# Altium project PCB_Project1.PrjPCB
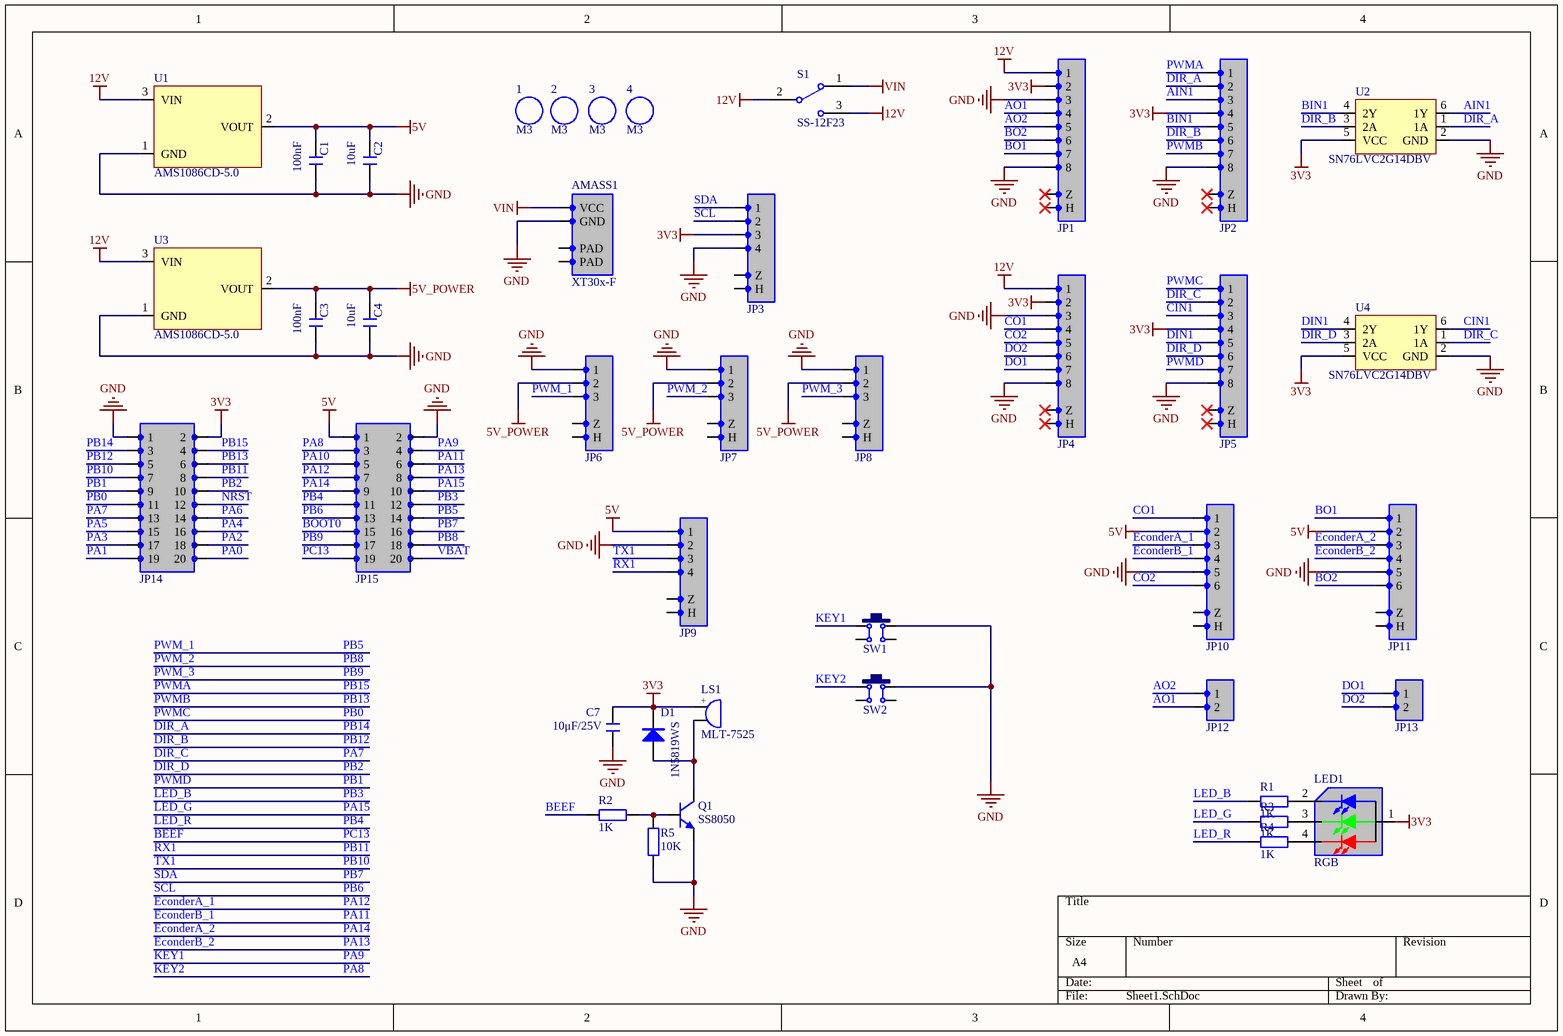
[diagram p0: Sheet1.SchDoc]
1 sheet, 41 parts. Net scope: global (net labels, ports and power ports of the same name join across sheets).
Board file: PCB2.PcbDoc

## Sheet Sheet1.SchDoc
size A4

### Parts
1  M3  [M3 125X200]
2  M3  [M3 125X200]
3  M3  [M3 125X200]
4  M3  [M3 125X200]
AMASS1  XT30x-F  [XT30U-M]
C1  100nF  [C 0603_L]
C2  10uF  [C 0603_L]
C3  100nF  [C 0603_L]
C4  10uF  [C 0603_L]
C7  10μF/25V  [C 0603_L]
D1  1N5819WS  [SOD-323]
JP1  HDR-1X8  [HDR2.54-M-LI-8P]  (value not drawn)
JP2  HDR-1X8  [HDR2.54-M-LI-8P]  (value not drawn)
JP3  HDR-1X4  [HDR2.54-M-LI-4P]  (value not drawn)
JP4  HDR-1X8  [HDR2.54-M-LI-8P]  (value not drawn)
JP5  HDR-1X8  [HDR2.54-M-LI-8P]  (value not drawn)
JP6  HDR-1X3  [HDR2.54-LI-3P]  (value not drawn)
JP7  HDR-1X3  [HDR2.54-LI-3P]  (value not drawn)
JP8  HDR-1X3  [HDR2.54-LI-3P]  (value not drawn)
JP9  HDR-1X4  [HDR2.54-LI-4P]  (value not drawn)
JP10  HDR-1X6  [XH2.54-WI-6P]  (value not drawn)
JP11  HDR-1X6  [XH2.54-WI-6P]  (value not drawn)
JP12  HDR-1X2  [XH2.54-WI-2P]  (value not drawn)
JP13  HDR-1X2  [XH2.54-WI-2P]  (value not drawn)
JP14  Header 2X10  [HDR2.54-LI-2x10P]  (value not drawn)
JP15  Header 2X10  [HDR2.54-LI-2x10P]  (value not drawn)
LED1  RGB  [LED 3528-RGB]
LS1  MLT-7525  [BUZZER_7525_S]
Q1  SS8050  [SOT23-3L]
R1  1K  [R 0603_L]
R2  1K  [R 0603_L]
R3  1K  [R 0603_L]
R4  1K  [R 0603_L]
R5  10K  [R 0603_L]
S1  SS-12F23  [SS-12D10]
SW1  6x6x5  [TSW SMD-3*4*2]  (value not drawn)
SW2  6x6x5  [TSW SMD-3*4*2]  (value not drawn)
U1  AMS1086CD-5.0  [TO252]
U2  SN76LVC2G14DBV  [SOT23-6N]
U3  AMS1086CD-5.0  [TO252]
U4  SN76LVC2G14DBV  [SOT23-6N]

### Nets
3V3: C7.1 D1.2(K) JP1.2 JP2.4 JP3.3 JP4.2 JP5.4 JP14.2 LED1.1 LS1.1 U2.5(VCC) U4.5(VCC)
5V: C1.1 C2.1 JP9.1 JP10.2 JP11.2 JP15.1 U1.2(VOUT)
5V_POWER: C3.1 C4.1 JP6.2 JP7.2 JP8.2 U3.2(VOUT)
12V: JP1.1 JP4.1 S1.2 S1.3 U1.3(VIN) U3.3(VIN)
GND: AMASS1.2(GND) C1.2 C2.2 C3.2 C4.2 C7.2 JP1.3 JP1.8 JP2.8 JP3.4 JP4.3 JP4.8 JP5.8 JP6.1 JP7.1 JP8.1 JP9.2 JP10.5 JP11.5 JP14.1 JP15.2 Q1.2(E) R5.2 SW1.2 SW2.2 U1.1(GND) U2.2(GND) U3.1(GND) U4.2(GND)
VIN: AMASS1.1(VCC) S1.1
AIN1: JP2.3 U2.6(1Y)
AO1: JP1.4 JP12.2
AO2: JP1.5 JP12.1
BEEF: JP15.19 R2.1  [also labelled PC13]
BIN1: JP2.5 U2.4(2Y)
BO1: JP1.7 JP11.1
BO2: JP1.6 JP11.6
BOOT0: JP15.15
CIN1: JP5.3 U4.6(1Y)
CO1: JP4.4 JP10.1
CO2: JP4.5 JP10.6
DIN1: JP5.5 U4.4(2Y)
DIR_A: JP2.2 JP14.3 U2.1(1A)  [also labelled PB14]
DIR_B: JP2.6 JP14.5 U2.3(2A)  [also labelled PB12]
DIR_C: JP5.2 JP14.13 U4.1(1A)  [also labelled PA7]
DIR_D: JP5.6 JP14.10 U4.3(2A)  [also labelled PB2]
DO1: JP4.7 JP13.1
DO2: JP4.6 JP13.2
EconderA_1: JP10.3 JP15.7  [also labelled PA12]
EconderA_2: JP11.3 JP15.9  [also labelled PA14]
EconderB_1: JP10.4 JP15.6  [also labelled PA11]
EconderB_2: JP11.4 JP15.8  [also labelled PA13]
KEY1: JP15.4 SW1.1  [also labelled PA9]
KEY2: JP15.3 SW2.1  [also labelled PA8]
LED_B: JP15.12 R1.1  [also labelled PB3]
LED_G: JP15.10 R3.1  [also labelled PA15]
LED_R: JP15.11 R4.1  [also labelled PB4]
NRST: JP14.12
PA0: JP14.20
PA1: JP14.19
PA2: JP14.18
PA3: JP14.17
PA4: JP14.16
PA5: JP14.15
PA6: JP14.14
PA10: JP15.5
PB0: JP5.1 JP14.11  [also labelled PWMC]
PB1: JP5.7 JP14.9  [also labelled PWMD]
PB5: JP6.3 JP15.14  [also labelled PWM_1]
PB6: JP3.2 JP15.13  [also labelled SCL]
PB7: JP3.1 JP15.16  [also labelled SDA]
PB8: JP7.3 JP15.18  [also labelled PWM_2]
PB9: JP8.3 JP15.17  [also labelled PWM_3]
PB10: JP9.3 JP14.7  [also labelled TX1]
PB11: JP9.4 JP14.8  [also labelled RX1]
PB13: JP2.7 JP14.6  [also labelled PWMB]
PB15: JP2.1 JP14.4  [also labelled PWMA]
VBAT: JP15.20
NetD1_1: D1.1(A) LS1.2 Q1.3(C)
NetLED1_2: LED1.2 R1.2
NetLED1_3: LED1.3 R3.2
NetLED1_4: LED1.4 R4.2
NetQ1_1: Q1.1(B) R2.2 R5.1

Not connected (* = marked no-connect by the designer): AMASS1 0(PAD) 100(PAD); JP1 0(Z)* 100(H)*; JP2 0(Z)* 100(H)*; JP3 0(Z) 100(H); JP4 0(Z)* 100(H)*; JP5 0(Z)* 100(H)*; JP6 0(Z) 100(H); JP7 0(Z) 100(H); JP8 0(Z) 100(H); JP9 0(Z) 100(H); JP10 0(Z) 100(H); JP11 0(Z) 100(H); SW1 3 4; SW2 3 4

### Notes on the sheet
- (in symbol Buzzer) +

### Library data of the parts
1-4 = M3: 铜柱孔; 版权归属: 源创客; BOM名称: 铜柱孔; 学习资源: www.ooocke.com
AMASS1 = XT30: Amass防打火电源接口，XT30系列
C1-C4 C7 = C: 无极性贴片电容; 版权归属: 源创客; BOM名称: 无极性贴片电容; 学习资源: www.ooocke.com
D1 = 1N4148: 高速开关二极管; 版权归属: 源创客; BOM名称: 高速开关二极管; 学习资源: www.ooocke.com
JP1 JP2 JP4 JP5 = Header 8: 8P接插件; 版权归属: 源创客; BOM名称: 8P接插件; 学习资源: www.ooocke.com
JP3 JP9 = Header 4: 4P接插件; 版权归属: 源创客; BOM名称: 4P接插件; 学习资源: www.ooocke.com
JP6-JP8 = Header 3: 3P接插件; 版权归属: 源创客; BOM名称: 3P接插件; 学习资源: www.ooocke.com
JP10 JP11 = Header 6: 6P接插件; 版权归属: 源创客; BOM名称: 6P接插件; 学习资源: www.ooocke.com
JP12 JP13 = Header 2: 2P接插件; 版权归属: 源创客; BOM名称: 2P接插件; 学习资源: www.ooocke.com
JP14 JP15 = Header 10X2: 10*2P接插件; 版权归属: 源创客; BOM名称: 10*2P接插件; 学习资源: www.ooocke.com
LED1 = LED-RGB-A: 共阳三基色LED; BOM名称: 三基色LED; 版权归属: 源创客; 学习资源: www.ooocke.com
LS1 = Buzzer: 蜂鸣器; 版权归属: 源创客; BOM名称: 蜂鸣器; 学习资源: www.ooocke.com
Q1 = 8050-SMD: 高频放大-NPN型; 版权归属: 源创客; 属性: 40V 1.5A 1W 100MHZ; BOM名称: 高频放大-NPN型; 学习资源: www.ooocke.com
R1-R5 = R: 贴片电阻; 版权归属: 源创客; BOM名称: 贴片电阻; 学习资源: www.ooocke.com
S1 = SSW-1P: 1路拨动开关; BOM名称: 波动开关; 版权归属: 源创客; 学习资源: www.ooocke.com
SW1 SW2 = TSW SMD-6x6: 贴片6x6轻触开关; 版权归属: 源创客; BOM名称: 贴片6x6轻触开关; 学习资源: www.ooocke.com